# EAGLE design EXIST-RIP_transformerPCB (EAGLE 9.1.3)
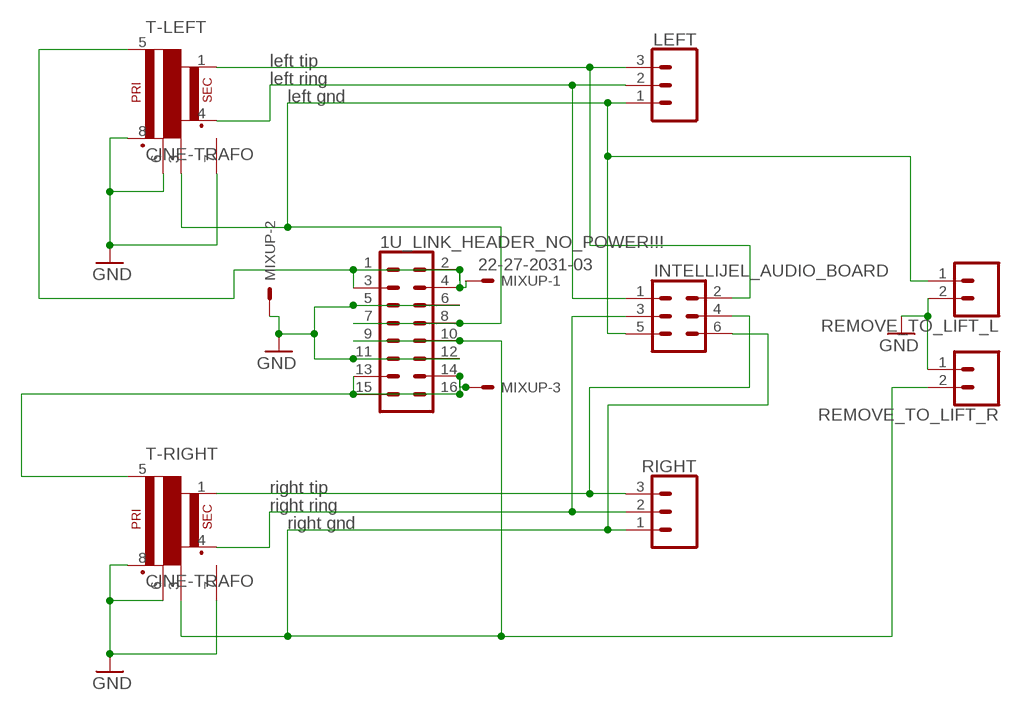
[diagram p0: schematic, sheet 1]

## Parts
1U_LINK_HEADER_NO_POWER!!!  CONN_08X2  [2X8]
INTELLIJEL_AUDIO_BOARD  CONN_03X22X3_SILK_MALE_PTH  [2X3]
LEFT  CONN_03LONGPADS  [1X03_LONGPADS]
MIXUP  22-27-2031-03  [6410-03]
REMOVE_TO_LIFT_L  CONN_02  [1X02]
REMOVE_TO_LIFT_R  CONN_02  [1X02]
RIGHT  CONN_03LONGPADS  [1X03_LONGPADS]
T-LEFT  CINE-TRAFO  [CIRC-TRAFO]
T-RIGHT  CINE-TRAFO  [CIRC-TRAFO]

## Nets
GND: 1U_LINK_HEADER_NO_POWER!!!.5 1U_LINK_HEADER_NO_POWER!!!.6 1U_LINK_HEADER_NO_POWER!!!.11 1U_LINK_HEADER_NO_POWER!!!.12 MIXUP.2 REMOVE_TO_LIFT_L.2 REMOVE_TO_LIFT_R.1 T-LEFT.6(C1) T-LEFT.7(CASE) T-LEFT.8(P2) T-RIGHT.6(C1) T-RIGHT.7(CASE) T-RIGHT.8(P2)
LEFT-GND: 1U_LINK_HEADER_NO_POWER!!!.7 1U_LINK_HEADER_NO_POWER!!!.8 INTELLIJEL_AUDIO_BOARD.5 LEFT.1 REMOVE_TO_LIFT_L.1 T-LEFT.3(C2)
LEFT-RING: INTELLIJEL_AUDIO_BOARD.1 LEFT.2 T-LEFT.4(S2)
N$2: INTELLIJEL_AUDIO_BOARD.2 LEFT.3 T-LEFT.1(S1)
N$3: INTELLIJEL_AUDIO_BOARD.4 RIGHT.3 T-RIGHT.1(S1)
N$4: INTELLIJEL_AUDIO_BOARD.3 RIGHT.2 T-RIGHT.4(S2)
N$6: 1U_LINK_HEADER_NO_POWER!!!.13 1U_LINK_HEADER_NO_POWER!!!.14 1U_LINK_HEADER_NO_POWER!!!.15 1U_LINK_HEADER_NO_POWER!!!.16 MIXUP.3 T-RIGHT.5(P1)
N$8: 1U_LINK_HEADER_NO_POWER!!!.1 1U_LINK_HEADER_NO_POWER!!!.2 1U_LINK_HEADER_NO_POWER!!!.3 1U_LINK_HEADER_NO_POWER!!!.4 MIXUP.1 T-LEFT.5(P1)
RIGHT-GND: 1U_LINK_HEADER_NO_POWER!!!.9 1U_LINK_HEADER_NO_POWER!!!.10 INTELLIJEL_AUDIO_BOARD.6 REMOVE_TO_LIFT_R.2 RIGHT.1 T-RIGHT.3(C2)

## Notes on the sheet
- left tip
- left ring
- left gnd
- right tip
- right ring
- right gnd

## Library data of the parts
1U_LINK_HEADER_NO_POWER!!! = SparkFun-Connectors:CONN_08X2: Multi connection point. Often used as Generic Header-pin footprint for 0.1 inch spaced/style header connections You can populate with any combo of single row headers, but if you'd like an exact match, check this: Header - 2x8 (Male, 0.1") <https://www.sparkfun.com/products/13156> (PRT-13156) On any of the 0.1 inch spaced packages, you can populate with these: Break Away Headers - Straight <https://www.sparkfun.com/products/116> (PRT-00116) Break Away Male Headers - Right Angle <https://www.sparkfun.com/products/553> (PRT-00553) Female Headers <https://www.sparkfun.com/products/115> (PRT-00115) Break Away Headers - Machine Pin <https://www.sparkfun.com/products/117> (PRT-00117) Break Away Female Headers - Swiss Machine Pin <https://www.sparkfun.com/products/743> (PRT-00743)
INTELLIJEL_AUDIO_BOARD = SparkFun-Connectors:CONN_03X2: Multi connection point. Often used as Generic Header-pin footprint for 0.1 inch spaced/style header connections You can populate with any combo of single row headers, but if you'd like an exact match, check these: Header - 2x3 (Male, 0.1") <https://www.sparkfun.com/products/12807> (PRT-12807) Header - 2x3 (Female, 0.1") <https://www.sparkfun.com/products/13010> (PRT-13010) 2x3 Pin Shrouded Header <https://www.sparkfun.com/products/10877> (PRT-10877) On any of the 0.1 inch spaced packages, you can populate with these: Break Away Headers - Straight <https://www.sparkfun.com/products/116> (PRT-00116) Break Away Male Headers - Right Angle <https://www.sparkfun.com/products/553> (PRT-00553) Female Headers <https://www.sparkfun.com/products/115> (PRT-00115) Break Away Headers - Machine Pin <https://www.sparkfun.com/products/117> (PRT-00117) Break Away Female Headers - Swiss Machine Pin <https://www.sparkfun.com/products/743> (PRT-00743) Special note: the shrouded connector mates well with our 3x2 ribbon cables: Ribbon Crimp Connector - 6-pin (2x3, Female) <https://www.sparkfun.com/products/10651> (PRT-10651) Ribbon Cable - 6 wire (15ft) <https://www.sparkfun.com/products/10646> (PRT-10646); PROD_ID: CONN-09701
LEFT RIGHT = SparkFun-Connectors:CONN_03: Multi connection point. Often used as Generic Header-pin footprint for 0.1 inch spaced/style header connections On any of the 0.1 inch spaced packages, you can populate with these: Break Away Headers - Straight <https://www.sparkfun.com/products/116> (PRT-00116) Break Away Male Headers - Right Angle <https://www.sparkfun.com/products/553> (PRT-00553) Female Headers <https://www.sparkfun.com/products/115> (PRT-00115) Break Away Headers - Machine Pin <https://www.sparkfun.com/products/117> (PRT-00117) Break Away Female Headers - Swiss Machine Pin <https://www.sparkfun.com/products/743> (PRT-00743) Stackable Header - 3 Pin (Female, 0.1") <https://www.sparkfun.com/products/13875> (PRT-13875) For SCREWTERMINALS and SPRING TERMINALS visit here: Screw Terimnals on SparkFun.com <https://www.sparkfun.com/search/results?term=Screw+Terminals> (5mm/3.5mm/2.54mm spacing) This device is also useful as a general connection point to wire up your design to another part of your project. Our various solder wires solder well into these plated through hole pads. Hook-Up Wire - Assortment (Stranded, 22 AWG) <https://www.sparkfun.com/products/11375> (PRT-11375) Hook-Up Wire - Assortment (Solid Core, 22 AWG) <https://www.sparkfun.com/products/11367> (PRT-11367) View the entire wire category on our website here <https://www.sparkfun.com/categories/141> Special notes: Molex polarized connector foot print use with SKU : PRT-08232 with associated crimp pins and housings.
MIXUP = con-molex:22-?-03: CONNECTOR wire to board 2.54 mm (.1 inch) pitch header; MF: MOLEX; OC_FARNELL: unknown; OC_NEWARK: unknown
REMOVE_TO_LIFT_L REMOVE_TO_LIFT_R = SparkFun-Connectors:CONN_02: Multi connection point. Often used as Generic Header-pin footprint for 0.1 inch spaced/style header connections On any of the 0.1 inch spaced packages, you can populate with these: Break Away Headers - Straight <https://www.sparkfun.com/products/116> (PRT-00116) Break Away Male Headers - Right Angle <https://www.sparkfun.com/products/553> (PRT-00553) Female Headers <https://www.sparkfun.com/products/115> (PRT-00115) Break Away Headers - Machine Pin <https://www.sparkfun.com/products/117> (PRT-00117) Break Away Female Headers - Swiss Machine Pin <https://www.sparkfun.com/products/743> (PRT-00743) For SCREWTERMINALS and SPRING TERMINALS visit here: Screw Terimnals on SparkFun.com <https://www.sparkfun.com/search/results?term=Screw+Terminals> (5mm/3.5mm/2.54mm spacing) This device is also useful as a general connection point to wire up your design to another part of your project. Our various solder wires solder well into these plated through hole pads. Hook-Up Wire - Assortment (Stranded, 22 AWG) <https://www.sparkfun.com/products/11375> (PRT-11375) Hook-Up Wire - Assortment (Solid Core, 22 AWG) <https://www.sparkfun.com/products/11367> (PRT-11367) View the entire wire category on our website here <https://www.sparkfun.com/categories/141> Special notes: Molex polarized connector foot print use with: PRT-08233 with associated crimp pins and housings. 2.54_SCREWTERM for use with PRT-10571. 3.5mm Screw Terminal footprints for PRT-08084 5mm Screw Terminal footprints for use with PRT-08432
T-LEFT T-RIGHT = monome_modular:CINE-TRAFO

## Board
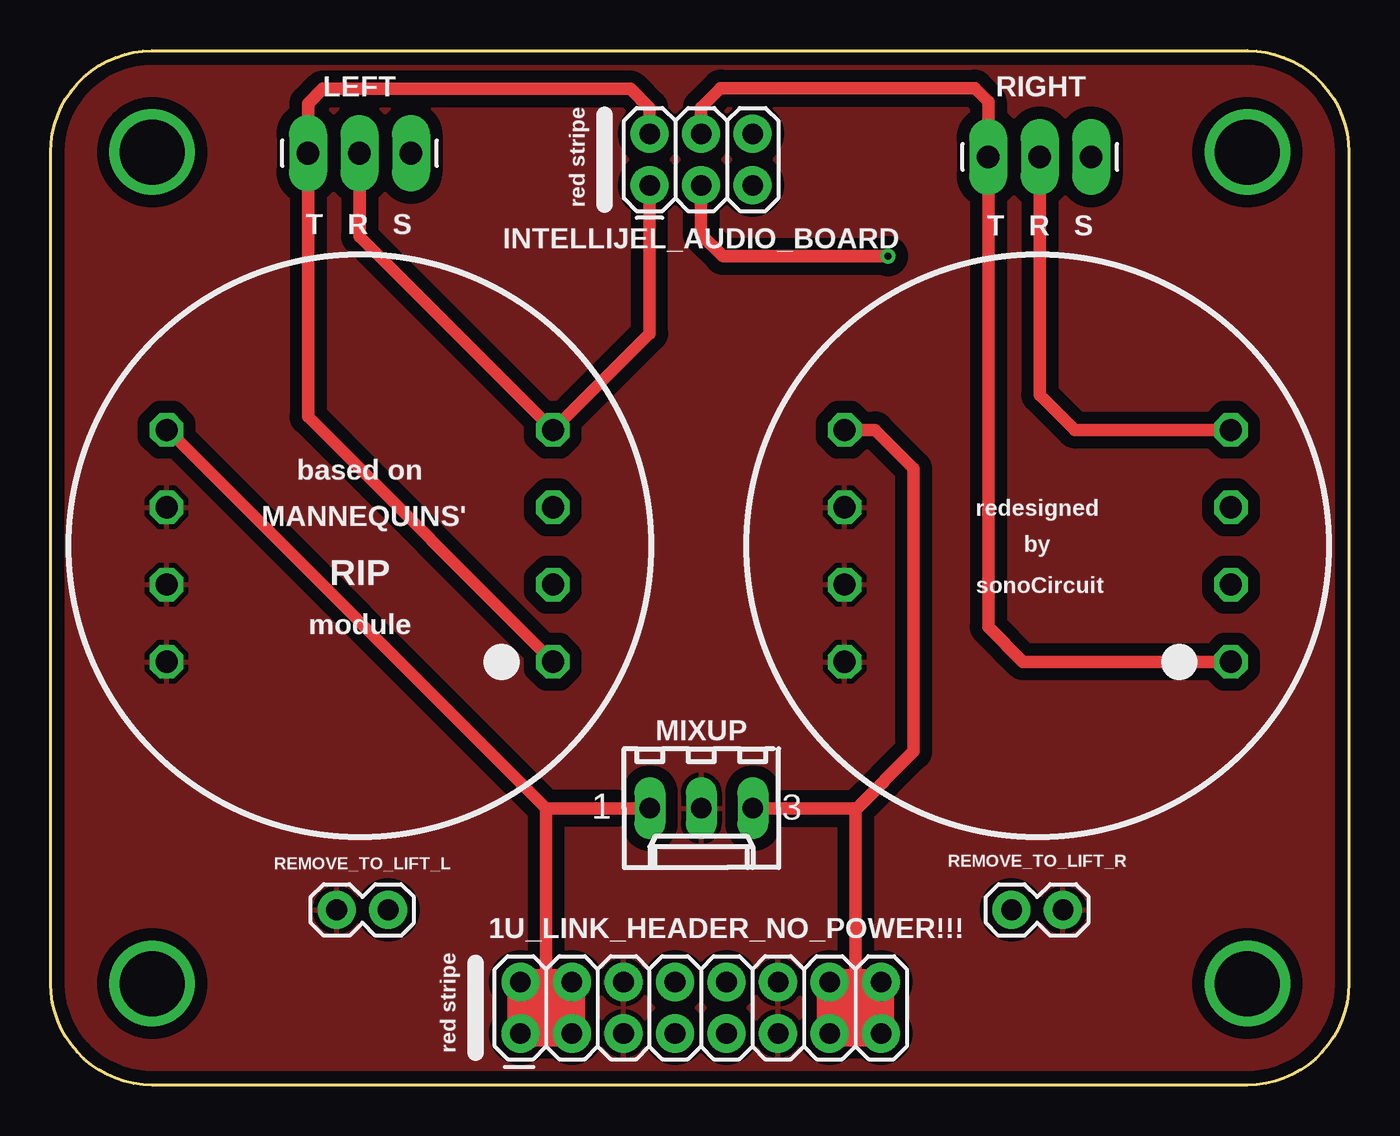
[diagram p1: board, top side]
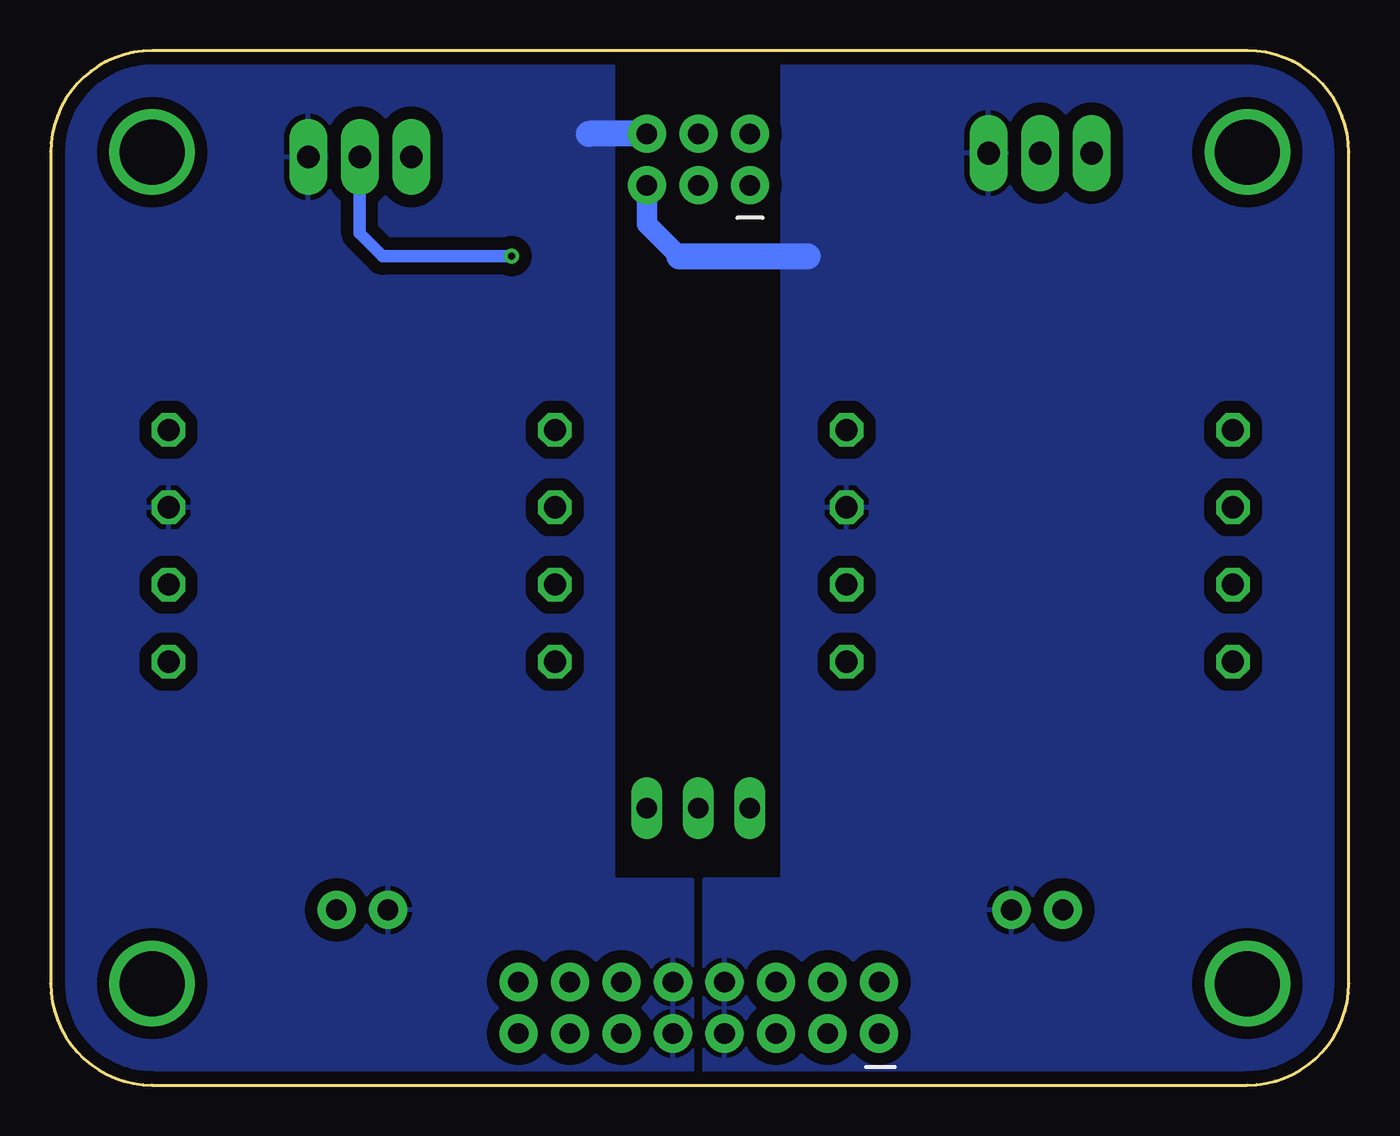
[diagram p2: board, bottom side, seen from below]

Size 64 x 51 mm. Coordinates in mm from the lower left corner, seen from the top.
Outline: 59,0 5,0 arc-90 0,5 0,46 arc-90 5,51 59,51 arc-90 64,46 64,5 arc-90 59,0
Copper layers (1*16): Top 0.035mm / dielectric 1.5mm / Bottom 0.035mm
Design rules "default *": minimum track width 6mil, minimum drill 0.35mm, track to track 6mil, track to pad 6mil, pad to pad 6mil, via to via 6mil, smd to smd 6mil, copper to edge 20mil, drill to drill 6mil, minimum pad ring 10mil, minimum via ring 8mil, stop-mask expansion 4mil, vias tented up to drill 0mil, thermal gap 10mil

### Footprints (pad centres in the part's own frame; a part is rotated, then mirrored left to right if it is on the bottom)
2X8 = drill 1.016 pad 1.88: 1 0,0; 2 0,2.54; 3 2.54,0; 4 2.54,2.54; 5 5.08,0; 6 5.08,2.54; 7 7.62,0; 8 7.62,2.54; 9 10.16,0; 10 10.16,2.54; 11 12.7,0; 12 12.7,2.54; 13 15.24,0; 14 15.24,2.54; 15 17.78,0; 16 17.78,2.54
2X3 = drill 1.016 pad 1.88: 1 0,0; 2 0,2.54; 3 2.54,0; 4 2.54,2.54; 5 5.08,0; 6 5.08,2.54
1X03_LONGPADS = drill 1.118 pad 1.88 long: 1 0,0; 2 2.54,0; 3 5.08,0
6410-03 = drill 1.016 long: 1 2.54,0; 2 0,0; 3 -2.54,0
1X02 = drill 1.016 pad 1.88: 1 0,0; 2 2.54,0
CIRC-TRAFO = drill 1.1 octagon: 1 -9.525,5.715; 2 -9.525,1.905; 3 -9.525,-1.905; 4 -9.525,-5.715; 5 9.525,-5.715; 6 9.525,-1.905; 7 9.525,1.905; 8 9.525,5.715

### Placement (x,y rotation side)
1U_LINK_HEADER_NO_POWER!!!  23.16,2.54 0 top
INTELLIJEL_AUDIO_BOARD  29.53,44.36 0 top
LEFT  17.76,45.95 180 top
MIXUP  32.08,13.65 180 top
REMOVE_TO_LIFT_L  16.64,8.64 180 top
REMOVE_TO_LIFT_R  49.91,8.64 180 top
RIGHT  51.3,45.76 180 top
T-LEFT  15.24,26.58 180 top
T-RIGHT  48.66,26.58 180 top

### Tracks (layer width: path | path; a pad name or v marks a point on that pad's centre or on a via)
GND
  pour Top (isolate 0.61): 59.4,0.1 5.1,0.1 arc-90 0.1,5.1 0.1,46 arc-90 5.1,51 59.2,51 arc-90 64.2,46 64.2,4.9 arc-90
LEFT-GND
  Bottom 0.61: 24.94,28.51 24.92,28.48
  Bottom 1.016: INTELLIJEL_AUDIO_BOARD.5 34.61,42.46 33.02,40.87
  Bottom 1.27: 33.02,40.87 26.67,40.87
  pour Bottom (isolate 0.61): 0.32,5.32 0.24,48.49 arc-90 2.79,51.04 27.98,50.99 27.98,10.16 31.81,10.16 31.81,0.44 5.19,0.44 arc-90
LEFT-RING
  Top 0.61: INTELLIJEL_AUDIO_BOARD.1 29.53,37.06 T-LEFT.4 15.22,41.84 LEFT.2
N$1  (via drill 3.2)
  other vias: 5,5
N$2
  Top 0.61: T-LEFT.1 12.68,32.95 LEFT.3 12.68,48.39 13.42,49.12 28.57,49.12 29.53,48.17 INTELLIJEL_AUDIO_BOARD.2
N$3
  Top 0.61: T-RIGHT.1 47.94,20.87 46.22,22.59 RIGHT.3 46.22,48.49 45.56,49.15 33.03,49.15 32.07,48.19 INTELLIJEL_AUDIO_BOARD.4
N$4  (via drill 0.35)
  Top 0.61: T-RIGHT.4 50.48,32.3 48.76,34.02 RIGHT.2 | INTELLIJEL_AUDIO_BOARD.3 32.07,41.94 33.14,40.87 v41.27,40.87
  Bottom 0.61: v41.27,40.87 47.62,40.87 48.76,42.01 RIGHT.2
N$5  (via drill 3.2)
  other vias: 59,5
N$6
  Top 0.61: 39.67,13.57 42.55,16.45 42.55,30.39 40.64,32.3 T-RIGHT.5 | MIXUP.3 39.67,13.65 39.67,13.57 | 39.67,13.57 39.67,3.81
  Top 1.016: 1U_LINK_HEADER_NO_POWER!!!.13 39.67,3.81 1U_LINK_HEADER_NO_POWER!!!.16
  Top 1.27: 1U_LINK_HEADER_NO_POWER!!!.14 1U_LINK_HEADER_NO_POWER!!!.16 1U_LINK_HEADER_NO_POWER!!!.15 | 1U_LINK_HEADER_NO_POWER!!!.15 1U_LINK_HEADER_NO_POWER!!!.14 | 1U_LINK_HEADER_NO_POWER!!!.14 1U_LINK_HEADER_NO_POWER!!!.13 1U_LINK_HEADER_NO_POWER!!!.15
N$7  (via drill 3.2)
  other vias: 59,46
N$8
  Top 0.61: 24.43,13.65 5.79,32.3 T-LEFT.5 | 24.43,13.65 24.43,3.81 | MIXUP.1 24.43,13.65
  Top 1.016: 1U_LINK_HEADER_NO_POWER!!!.2 24.43,3.81 | 24.43,3.81 1U_LINK_HEADER_NO_POWER!!!.3 | 1U_LINK_HEADER_NO_POWER!!!.1 24.43,3.81 | 24.43,3.81 1U_LINK_HEADER_NO_POWER!!!.4
  Top 1.27: 1U_LINK_HEADER_NO_POWER!!!.2 1U_LINK_HEADER_NO_POWER!!!.4 | 1U_LINK_HEADER_NO_POWER!!!.4 1U_LINK_HEADER_NO_POWER!!!.3 | 1U_LINK_HEADER_NO_POWER!!!.1 1U_LINK_HEADER_NO_POWER!!!.2 | 1U_LINK_HEADER_NO_POWER!!!.2 1U_LINK_HEADER_NO_POWER!!!.3 | 1U_LINK_HEADER_NO_POWER!!!.1 1U_LINK_HEADER_NO_POWER!!!.4 | 1U_LINK_HEADER_NO_POWER!!!.1 1U_LINK_HEADER_NO_POWER!!!.3
N$9  (via drill 3.2)
  other vias: 5,46
RIGHT-GND
  Bottom 1.27: INTELLIJEL_AUDIO_BOARD.6 37.47,46.9
  pour Bottom (isolate 0.61): 32.37,10.16 32.37,0.52 60.02,0.52 arc90 64,4.5 64,51.48 36.26,51.48 36.26,10.16 32.38,10.16

### Text on the board
tNames: red stripe | T R S | T R S | based on | MANNEQUINS' | redesigned | by | RIP | sonoCircuit | module | red stripe